# EAGLE design Power+noise (EAGLE 6.5.0)
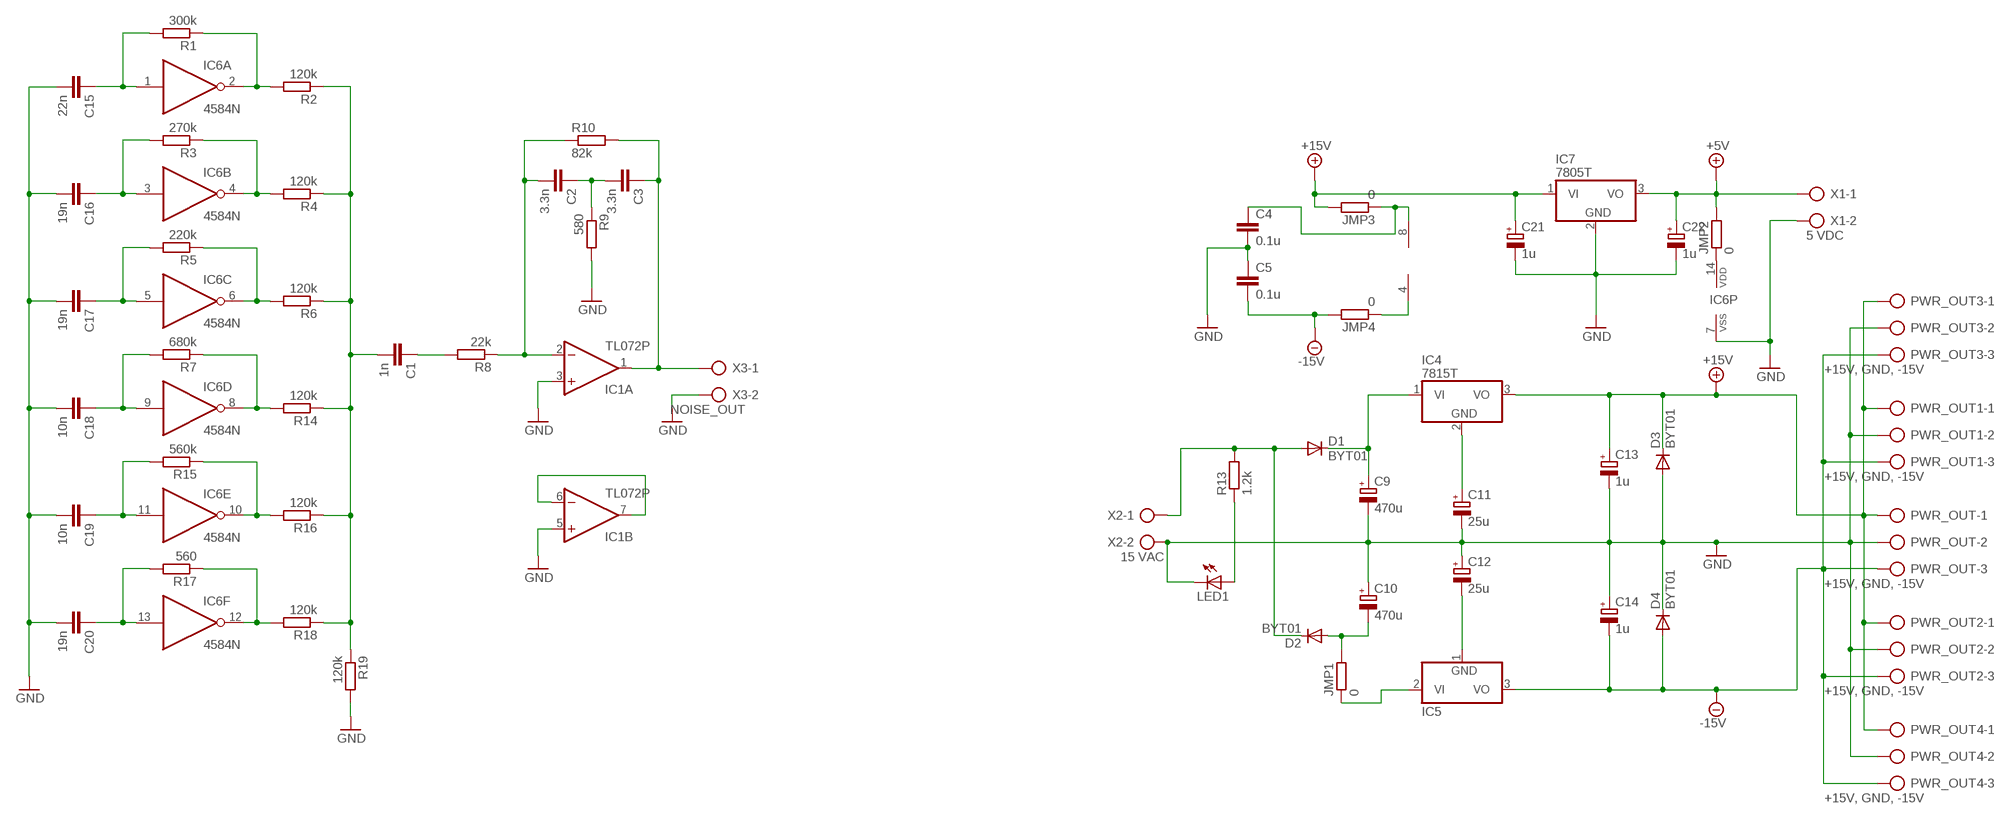
[diagram p0: schematic, sheet 1]

## Parts
C1  1n  C-EU075-042X103  [C075-042X103]
C2  3.3n  C-EU075-042X103  [C075-042X103]
C3  3.3n  C-EU075-042X103  [C075-042X103]
C4  0.1u  C-EU075-042X103  [C075-042X103]
C5  0.1u  C-EU075-042X103  [C075-042X103]
C9  470u  CPOL-EUE5-6  [E5-6]
C10  470u  CPOL-EUE5-6  [E5-6]
C11  25u  CPOL-EUE5-6  [E5-6]
C12  25u  CPOL-EUE5-6  [E5-6]
C13  1u  CPOL-EUE5-6  [E5-6]
C14  1u  CPOL-EUE5-6  [E5-6]
C15  22n  C-EU075-042X103  [C075-042X103]
C16  19n  C-EU075-042X103  [C075-042X103]
C17  19n  C-EU075-042X103  [C075-042X103]
C18  10n  C-EU075-042X103  [C075-042X103]
C19  10n  C-EU075-042X103  [C075-042X103]
C20  19n  C-EU075-042X103  [C075-042X103]
C21  1u  CPOL-EUE5-6  [E5-6]
C22  1u  CPOL-EUE5-6  [E5-6]
D1  BYT01  [F126-10]
D2  BYT01  [F126-10]
D3  BYT01  [F126-10]
D4  BYT01  [F126-10]
IC1  TL072P  [DIL08]
IC4  7815T  [TO220H]
IC5  7915T  [TO220H]
IC6  4584N  [DIL14]
IC7  7805T  [TO220H]
JMP1  0  R-EU_0207/10  [0207/10]
JMP2  0  R-EU_0207/10  [0207/10]
JMP3  0  R-EU_0207/12  [0207/12]
JMP4  0  R-EU_0207/10  [0207/10]
LED1  LED5MM  [LED5MM]
PWR_OUT  +15V, GND, -15V  AK300/3  [AK300/3]
PWR_OUT1  +15V, GND, -15V  AK300/3  [AK300/3]
PWR_OUT2  +15V, GND, -15V  AK300/3  [AK300/3]
PWR_OUT3  +15V, GND, -15V  AK300/3  [AK300/3]
PWR_OUT4  +15V, GND, -15V  AK300/3  [AK300/3]
R1  300k  R-EU_0207/5V  [0207/5V]
R2  120k  R-EU_0207/5V  [0207/5V]
R3  270k  R-EU_0207/5V  [0207/5V]
R4  120k  R-EU_0207/5V  [0207/5V]
R5  220k  R-EU_0207/5V  [0207/5V]
R6  120k  R-EU_0207/5V  [0207/5V]
R7  680k  R-EU_0207/5V  [0207/5V]
R8  22k  R-EU_0207/5V  [0207/5V]
R9  580  R-EU_0207/5V  [0207/5V]
R10  82k  R-EU_0207/5V  [0207/5V]
R13  1.2k  R-EU_0207/5V  [0207/5V]
R14  120k  R-EU_0207/5V  [0207/5V]
R15  560k  R-EU_0207/5V  [0207/5V]
R16  120k  R-EU_0207/5V  [0207/5V]
R17  560  R-EU_0207/5V  [0207/5V]
R18  120k  R-EU_0207/5V  [0207/5V]
R19  120k  R-EU_0207/5V  [0207/5V]
X1  5 VDC  AK300/2  [AK300/2]
X2  15 VAC  AK300/2  [AK300/2]
X3  NOISE_OUT  AK300/2  [AK300/2]

## Nets
+5V: C22.+ IC7.3(VO) JMP2.2 X1.1
+15V: C13.+ C21.+ D3.C IC4.3(VO) IC7.1(VI) JMP3.2 PWR_OUT1.1 PWR_OUT2.1 PWR_OUT3.1 PWR_OUT4.1 PWR_OUT.1
-15V: C5.2 C14.- D4.A IC5.3(VO) JMP4.2 PWR_OUT1.3 PWR_OUT2.3 PWR_OUT3.3 PWR_OUT4.3 PWR_OUT.3
GND: C4.2 C5.1 C9.- C10.+ C11.- C12.+ C13.- C14.+ C15.2 C16.2 C17.2 C18.2 C19.2 C20.2 C21.- C22.- D3.A D4.C IC1.3(A:+IN) IC1.5(B:+IN) IC6.7(P:VSS) IC7.2(GND) LED1.K(C) PWR_OUT1.2 PWR_OUT2.2 PWR_OUT3.2 PWR_OUT4.2 PWR_OUT.2 R9.2 R19.2 X1.2 X2.2 X3.2
N$1: C1.2 R2.1 R4.1 R6.1 R14.1 R16.1 R18.1 R19.1
N$2: IC6.12(F:O) R17.1 R18.2
N$3: IC6.10(E:O) R15.1 R16.2
N$4: IC6.8(D:O) R7.1 R14.2
N$5: IC6.6(C:O) R5.1 R6.2
N$6: IC6.4(B:O) R3.1 R4.2
N$7: IC6.2(A:O) R1.1 R2.2
N$8: C20.1 IC6.13(F:I) R17.2
N$9: C19.1 IC6.11(E:I) R15.2
N$10: C10.- D2.A JMP1.2
N$11: C1.1 R8.2
N$12: C2.2 IC1.2(A:-IN) R8.1 R10.1
N$13: C3.1 IC1.1(A:OUT) R10.2 X3.1
N$14: C2.1 C3.2 R9.1
N$15: C18.1 IC6.9(D:I) R7.2
N$16: C17.1 IC6.5(C:I) R5.2
N$17: C16.1 IC6.3(B:I) R3.2
N$18: C15.1 IC6.1(A:I) R1.2
N$19: D1.A D2.C R13.2 X2.1
N$20: LED1.A R13.1
N$21: IC1.6(B:-IN) IC1.7(B:OUT)
N$22: C9.+ D1.C IC4.1(VI)
N$23: IC5.2(VI) JMP1.1
N$24: C11.+ IC4.2(GND)
N$25: IC6.14(P:VDD) JMP2.1
N$26: C12.- IC5.1(GND)
N$27: IC1.4(P:V-) JMP4.1
N$28: C4.1 IC1.8(P:V+) JMP3.1

## Library data of the parts
C1-C5 C15-C20 = rcl:C-EU: CAPACITOR, European symbol
C9-C14 C21 C22 = rcl:CPOL-EU: POLARIZED CAPACITOR, European symbol
D1-D4 = diode:BYT01: DIODE ultra fast
IC1 = linear:TL072: OP AMP
IC4 IC7 = linear:78*: Positive VOLTAGE REGULATOR Source: http://cache.national.com/ds/LM/LM78L05.pdf http://www.fairchildsemi.com/ds/LM/LM7805.pdf
IC5 = linear:79*: Negative VOLTAGE REGULATOR
IC6 = 45xx:4584: Hex SCHMITT TRIGGER (74C14)
JMP1-JMP4 R1-R10 R13-R19 = rcl:R-EU_: RESISTOR, European symbol
LED1 = led:LED: LED OSRAM: - CHIPLED LG R971, LG N971, LY N971, LG Q971, LY Q971, LO R971, LY R971 LH N974, LH R974 LS Q976, LO Q976, LY Q976 LO Q996 - Hyper CHIPLED LW Q18S LB Q993, LB Q99A, LB R99A - SideLED LS A670, LO A670, LY A670, LG A670, LP A670 LB A673, LV A673, LT A673, LW A673 LH A674 LY A675 LS A676, LA A676, LO A676, LY A676, LW A676 LS A679, LY A679, LG A679 - Hyper Micro SIDELED® LS Y876, LA Y876, LO Y876, LY Y876 LT Y87S - SmartLED LW L88C, LW L88S LB L89C, LB L89S, LG L890 LS L89K, LO L89K, LY L89K LS L896, LA L896, LO L896, LY L896 - TOPLED LS T670, LO T670, LY T670, LG T670, LP T670 LSG T670, LSP T670, LSY T670, LOP T670, LYG T670 LG T671, LOG T671, LSG T671 LB T673, LV T673, LT T673, LW T673 LH T674 LS T676, LA T676, LO T676, LY T676, LB T676, LH T676, LSB T676, LW T676 LB T67C, LV T67C, LT T67C, LS T67K, LO T67K, LY T67K, LW E67C LS E67B, LA E67B, LO E67B, LY E67B, LB E67C, LV E67C, LT E67C LW T67C LS T679, LY T679, LG T679 LS T770, LO T770, LY T770, LG T770, LP T770 LB T773, LV T773, LT T773, LW T773 LH T774 LS E675, LA E675, LY E675, LS T675 LS T776, LA T776, LO T776, LY T776, LB T776 LHGB T686 LT T68C, LB T68C - Hyper Mini TOPLED® LB M676 - Mini TOPLED Santana® LG M470 LS M47K, LO M47K, LY M47K Source: http://www.osram.convergy.de LUXEON: - LUMILED® LXK2-PW12-R00, LXK2-PW12-S00, LXK2-PW14-U00, LXK2-PW14-V00 LXK2-PM12-R00, LXK2-PM12-S00, LXK2-PM14-U00 LXK2-PE12-Q00, LXK2-PE12-R00, LXK2-PE12-S00, LXK2-PE14-T00, LXK2-PE14-U00 LXK2-PB12-K00, LXK2-PB12-L00, LXK2-PB12-M00, LXK2-PB14-N00, LXK2-PB14-P00, LXK2-PB14-Q00 LXK2-PR12-L00, LXK2-PR12-M00, LXK2-PR14-Q00, LXK2-PR14-R00 LXK2-PD12-Q00, LXK2-PD12-R00, LXK2-PD12-S00 LXK2-PH12-R00, LXK2-PH12-S00 LXK2-PL12-P00, LXK2-PL12-Q00, LXK2-PL12-R00 Source: www.luxeon.com KINGBRIGHT: KA-3528ASYC Source: www.kingbright.com
PWR_OUT PWR_OUT1-PWR_OUT4 = con-ptr500:AK300/3: CONNECTOR; OC_FARNELL: unknown; OC_NEWARK: unknown
X1-X3 = con-ptr500:AK300/2: CONNECTOR; OC_FARNELL: unknown; OC_NEWARK: unknown

## Board
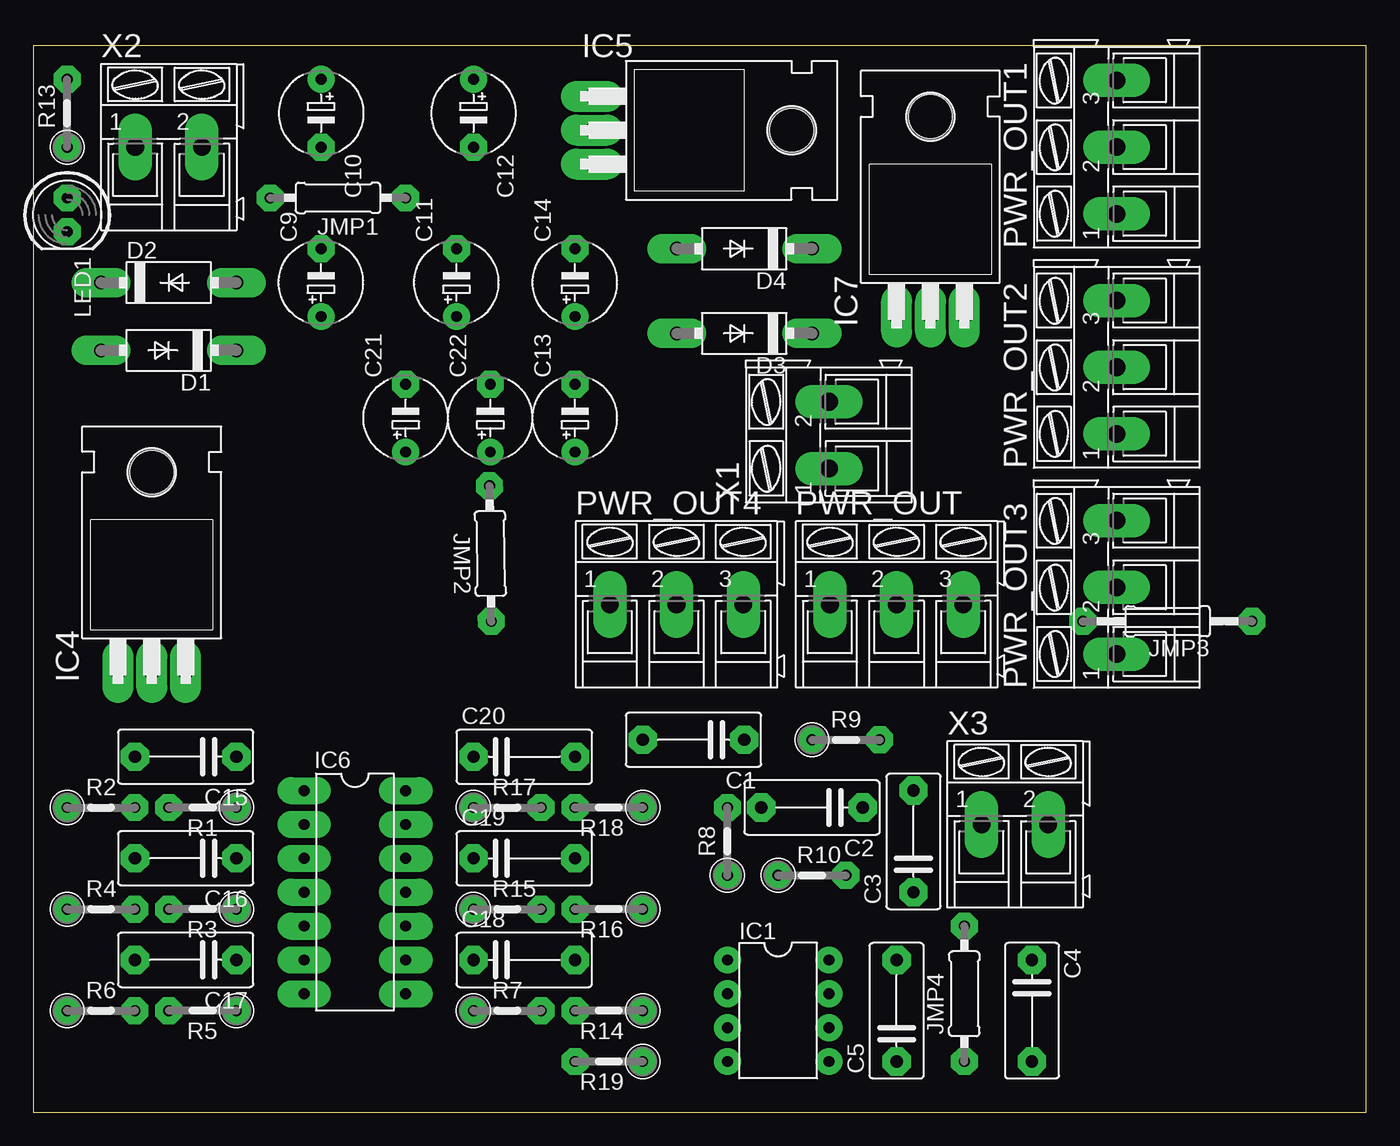
[diagram p1: board, top side]
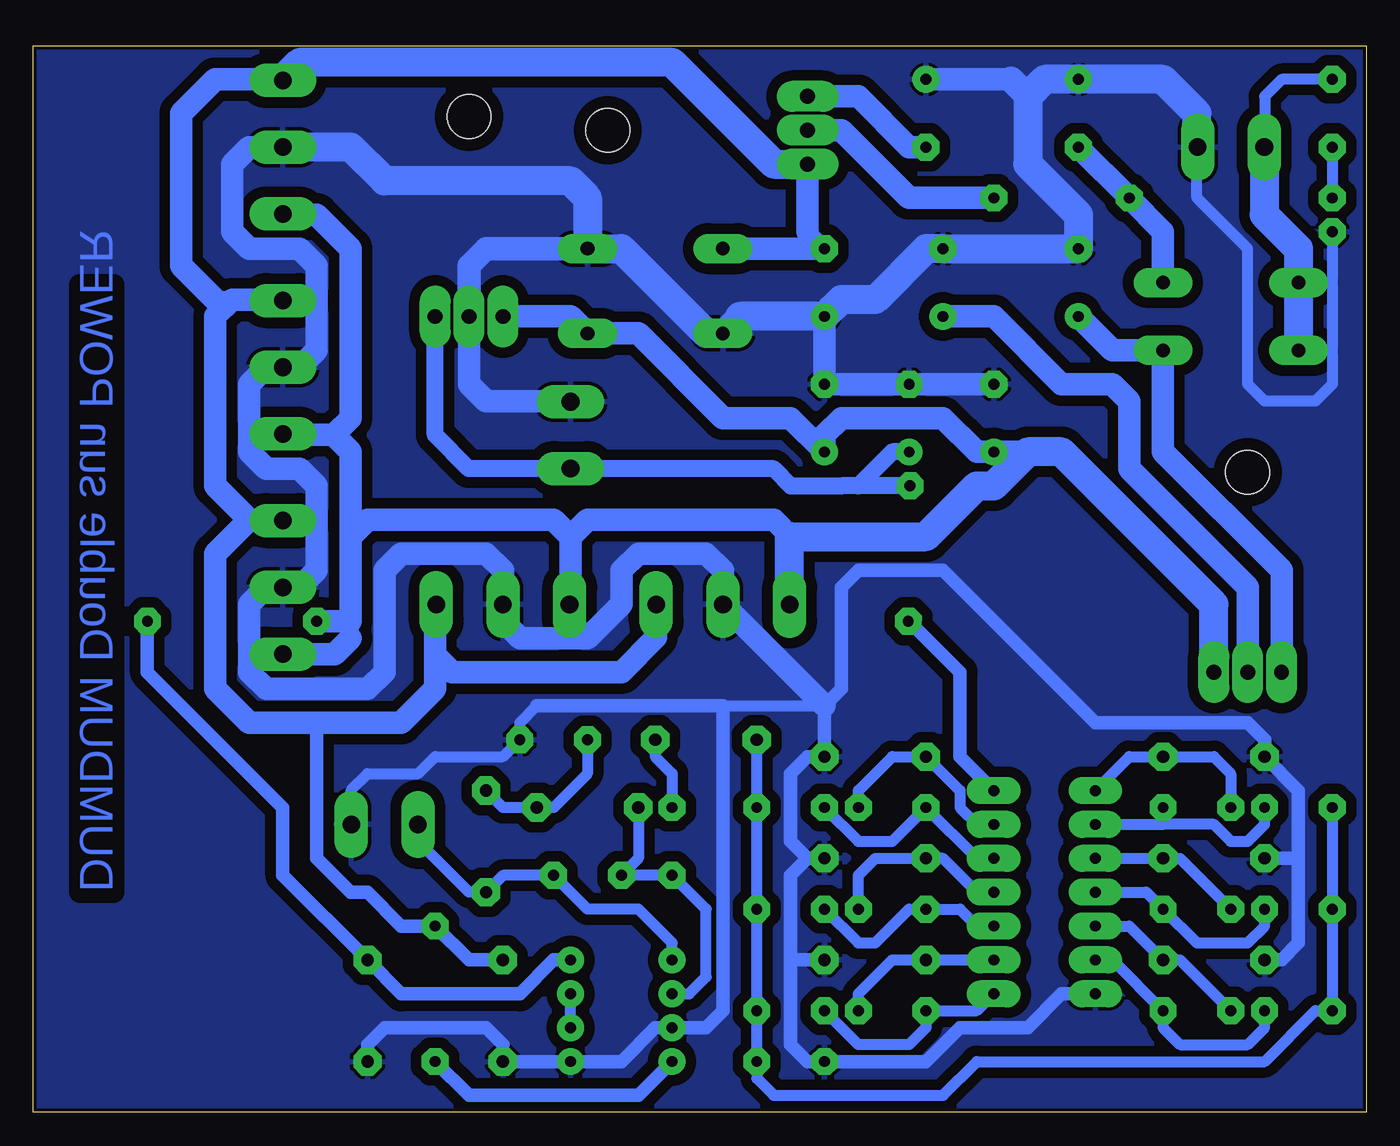
[diagram p2: board, bottom side, seen from below]

Size 100 x 80 mm. Coordinates in mm from the lower left corner, seen from the top.
Outline: 0,0 100,0 100,80 0,80 0,0
Copper layers (1*16): Top 0.035mm / dielectric 1.5mm / Bottom 0.035mm
Design rules "hobby-desingrules": minimum track width 0.8mm, minimum drill 0.8mm, track to track 0.8mm, track to pad 0.8mm, pad to pad 0.45mm, via to via 0.8mm, smd to smd 8mil, copper to edge 10mil, drill to drill 8mil, minimum pad ring 0.6mm, minimum via ring 0.6mm, stop-mask expansion 0mil, vias tented up to drill 0mil, thermal gap 10mil

### Footprints (pad centres in the part's own frame; a part is rotated, then mirrored left to right if it is on the bottom)
C075-042X103 = drill 0.914 octagon: 1 -3.81,0; 2 3.81,0
E5-6 = drill 0.813 pad 1.905: + -2.54,0 | drill 0.813 pad 1.905 octagon: - 2.54,0
F126-10 = drill 1.016 long: A 5.08,0; C -5.08,0
DIL08 = drill 0.813 pad 1.27: 1 -3.81,-3.81; 2 -1.27,-3.81; 3 1.27,-3.81; 4 3.81,-3.81; 5 3.81,3.81; 6 1.27,3.81; 7 -1.27,3.81; 8 -3.81,3.81
TO220H = drill 1.118 long: 1 -2.54,-10.16; 2 0,-10.16; 3 2.54,-10.16 | hole 3.302: 0,4.826
DIL14 = drill 0.813 long: 1 -7.62,-3.81; 2 -5.08,-3.81; 3 -2.54,-3.81; 4 0,-3.81; 5 2.54,-3.81; 6 5.08,-3.81; 7 7.62,-3.81; 8 7.62,3.81; 9 5.08,3.81; 10 2.54,3.81; 11 0,3.81; 12 -2.54,3.81; 13 -5.08,3.81; 14 -7.62,3.81
0207/10 = drill 0.813 octagon: 1 -5.08,0; 2 5.08,0
0207/12 = drill 0.813 octagon: 1 -6.35,0; 2 6.35,0
LED5MM = drill 0.813 octagon: A -1.27,0; K 1.27,0
AK300/3 = drill 1.321 long: 1 -5.004,0; 2 0,0; 3 5.004,0
0207/5V = drill 0.813 octagon: 1 -2.54,0; 2 2.54,0
AK300/2 = drill 1.321 long: 1 -2.515,0; 2 2.489,0

### Placement (x,y rotation side)
C1  49.53,27.94 180 top
C2  58.42,22.86 180 top
C3  66.04,20.32 90 top
C4  74.93,7.62 270 top
C5  64.77,7.62 90 top
C9  21.59,62.23 90 top
C10  21.59,74.93 270 top
C11  31.75,62.23 90 top
C12  33.02,74.93 270 top
C13  40.64,52.07 90 top
C14  40.64,62.23 90 top
C15  11.43,26.67 180 top
C16  11.43,19.05 180 top
C17  11.43,11.43 180 top
C18  36.83,11.43 0 top
C19  36.83,19.05 0 top
C20  36.83,26.67 0 top
C21  27.94,52.07 90 top
C22  34.29,52.07 90 top
D1  10.16,57.15 180 top
D2  10.16,62.23 0 top
D3  53.34,58.42 180 top
D4  53.34,64.77 180 top
IC1  55.88,7.62 270 top
IC4  8.89,43.18 0 top
IC5  52.07,73.66 270 top
IC6  24.13,16.51 270 top
IC7  67.31,69.85 0 top
JMP1  22.86,68.58 180 top
JMP2  34.29,41.91 90.8 top
JMP3  85.09,36.83 180 top
JMP4  69.85,8.89 90 top
LED1  2.54,67.31 270 top
PWR_OUT  64.77,38.1 0 top
PWR_OUT1  81.28,72.39 90 top
PWR_OUT2  81.28,55.88 90 top
PWR_OUT3  81.28,39.37 90 top
PWR_OUT4  48.26,38.1 0 top
R1  12.7,22.86 180 top
R2  5.08,22.86 0 top
R3  12.7,15.24 180 top
R4  5.08,15.24 0 top
R5  12.7,7.62 180 top
R6  5.08,7.62 0 top
R7  35.56,7.62 0 top
R8  52.07,20.32 90 top
R9  60.96,27.94 0 top
R10  58.42,17.78 0 top
R13  2.54,74.93 90 top
R14  43.18,7.62 180 top
R15  35.56,15.24 0 top
R16  43.18,15.24 180 top
R17  35.56,22.86 0 top
R18  43.18,22.86 180 top
R19  43.18,3.81 180 top
X1  59.69,50.8 90 top
X2  10.16,72.39 0 top
X3  73.66,21.59 0 top

### Tracks (layer width: path | path; a pad name or v marks a point on that pad's centre or on a via)
+5V
  Bottom 1.27: C22.+ 35.56,49.53 38.1,46.99 39.37,46.99 | JMP2.2 39.37,46.99 | 39.37,46.99 | 39.37,46.99 43.18,46.99 44.45,48.26 59.72,48.26 | 60.96,48.26 59.72,48.26 | 59.72,48.26 X1.1 67.33,48.28 69.85,50.8 IC7.3
+15V
  Bottom 1.27: 59.69,38.02 PWR_OUT.1 | 81.36,50.8 PWR_OUT2.1 81.2,50.8 | 81.36,67.31 PWR_OUT1.1 | 76.2,35.56 76.2,36.83 | 43.26,43.1 43.18,43.18
  Bottom 1.676: IC7.1 59.69,59.69 D3.C 54.61,58.42 48.26,52.07 43.18,52.07 C13.+ 40.64,50.8 39.37,52.07 31.75,52.07 29.21,49.53 C21.+ 25.4,49.53 | 81.36,67.31 78.74,67.31 76.2,64.77 76.2,52.07 77.47,50.8 | 77.47,50.8 81.2,50.8 | PWR_OUT3.1 77.39,34.37 76.2,35.56 | 76.2,43.18 76.2,36.83 JMP3.2 | 76.2,43.18 76.2,49.53 77.47,50.8 | 59.69,38.02 59.69,43.18 | 59.69,43.18 60.96,44.45 74.93,44.45 76.2,43.18 | 59.69,43.18 58.42,44.45 44.45,44.45 43.18,43.18
  Bottom 2.184: IC4.3 11.43,38.1 22.86,49.53 25.4,49.53 27.94,46.99 29.21,46.99 33.02,43.18 43.18,43.18 | PWR_OUT4.1 43.26,43.1
-15V
  Bottom 1.016: C5.2 67.31,11.43 JMP4.2 72.39,13.97 74.93,16.51 76.2,16.51 78.74,19.05 78.74,29.21
  Bottom 1.27: 41.91,66.04 C14.- | 81.28,77.47 PWR_OUT1.3 | 69.85,38.1 69.85,38.18 PWR_OUT.3 69.85,38.02 | PWR_OUT3.3 81.2,44.45 83.82,44.45 83.74,44.37 | 81.2,60.96 PWR_OUT2.3 | 85.09,60.96 86.36,60.96
  Bottom 1.676: IC5.3 41.91,66.04 | C14.- D4.A | 81.2,60.96 85.09,60.96 86.36,59.69 86.36,46.99 83.82,44.45 86.36,41.91 86.36,31.75 83.82,29.21 78.74,29.21 72.39,29.21 69.85,31.75 69.85,34.29 | 86.36,60.96 88.9,63.5 88.9,74.93 86.36,77.47 81.36,77.47 | PWR_OUT3.3 83.74,44.37 | 69.85,34.29 69.85,38.02 | PWR_OUT4.3 53.26,35.64 55.88,33.02 68.58,33.02 69.85,34.29
  Bottom 2.184: IC5.3 44.45,71.12 52.07,78.74 80.01,78.74 81.28,77.47 | 81.36,77.47 PWR_OUT1.3
GND
  Bottom 0.813: 12.7,72.34 12.7,68.58 8.89,64.77 8.89,54.61 7.62,53.34 3.81,53.34 2.54,54.61 LED1.K | 48.26,30.48 40.64,30.48 | 62.23,30.48 63.5,29.21 R9.2 64.77,26.67 69.85,26.67 71.12,25.4 74.93,25.4 76.15,24.18 X3.2 | 64.77,5.08 C5.1
  Bottom 1.016: 41.91,19.05 43.18,20.32 43.18,25.4 41.91,26.67 C20.2 40.64,30.48 39.37,31.75 39.37,39.37 38.1,40.64 31.75,40.64 20.32,29.21 8.89,29.21 7.62,27.94 C15.2 5.08,24.13 5.08,19.05 | 41.91,19.05 C19.2 | 43.18,11.43 43.18,17.78 41.91,19.05 | C18.2 43.18,11.43 | 5.08,19.05 5.08,12.7 6.35,11.43 C17.2 | C16.2 5.08,19.05 | IC6.7 22.86,8.89 25.4,6.35 30.48,6.35 33.02,3.81 R19.2 41.91,3.81 43.18,5.08 43.18,11.43 | 62.23,30.48 48.26,30.48 48.26,7.62 49.53,6.35 IC1.3 53.34,6.35 55.88,3.81 IC1.5 C5.1 | C4.2 74.93,5.08 73.66,6.35 66.04,6.35 64.77,5.08
  Bottom 1.27: 82.55,55.88 PWR_OUT2.2 | 80.01,39.37 PWR_OUT3.2 | 59.74,53.34 X1.2
  Bottom 1.676: C14.+ C13.- C22.- C21.- | PWR_OUT2.2 80.01,55.88 78.74,57.15 78.74,63.5 80.01,64.77 83.82,64.77 85.09,66.04 85.09,71.12 83.82,72.39 PWR_OUT1.2 | 82.55,55.88 83.82,54.61 83.82,49.53 82.55,48.26 80.01,48.26 78.74,46.99 78.74,40.64 80.01,39.37 | PWR_OUT3.2 82.55,39.37 83.82,38.1 83.82,33.02 82.55,31.75 74.93,31.75 73.66,33.02 73.66,40.64 72.39,41.91 66.04,41.91 64.77,40.64 PWR_OUT.2 64.77,36.83 63.5,35.56 58.42,35.56 55.88,38.1 55.88,40.64 54.61,41.91 49.53,41.91 48.26,40.64 PWR_OUT4.2 40.64,30.48 | IC7.2 67.31,54.61 66.04,53.34 59.74,53.34 | 26.67,77.47 C12.+
  Bottom 1.778: D4.C 66.04,64.77 67.31,63.5 IC7.2
  Bottom 1.93: 12.7,72.34 X2.2 | 26.67,77.47 25.4,76.2 | 46.99,59.69 D3.A
  Bottom 2.184: 12.7,72.34 12.7,74.93 15.24,77.47 C10.+ 24.13,77.47 25.4,76.2 25.4,71.12 21.59,67.31 C9.- C11.- 33.02,64.77 36.83,60.96 39.37,60.96 C14.+ 46.99,59.69 | D3.A 49.53,58.42 55.88,64.77 D4.C 58.42,68.58 59.69,69.85 73.66,69.85 76.2,72.39 PWR_OUT1.2
  pour Bottom: 0,80.01 100.33,80.01 100.33,0 0,0
N$1
  Bottom 0.813: R2.1 R4.1 R6.1 3.81,7.62 7.62,3.81 29.21,3.81 31.75,1.27 44.45,1.27 45.72,2.54 R19.1 R14.1 R16.1 R18.1 C1.2
N$2
  Bottom 0.813: IC6.12 29.21,19.05 R17.1 35.56,20.32 38.1,20.32 R18.2
N$3
  Bottom 0.813: IC6.10 29.21,13.97 30.48,15.24 R15.1 34.29,15.24 36.83,12.7 38.1,12.7 R16.2
N$4
  Bottom 0.813: IC6.8 29.21,7.62 R7.1 33.02,6.35 34.29,5.08 38.1,5.08 R14.2
N$5
  Bottom 0.813: IC6.6 19.05,11.43 R5.1 15.24,6.35 13.97,5.08 8.89,5.08 7.62,6.35 R6.2
N$6
  Bottom 0.813: IC6.4 16.51,16.51 R3.1 12.7,12.7 8.89,12.7 7.62,13.97 R4.2
N$7
  Bottom 0.813: IC6.2 15.24,21.59 | R2.2 7.62,21.59 8.89,20.32 10.16,20.32 11.43,21.59 15.24,21.59 | 15.24,21.59 R1.1
N$8
  Bottom 0.813: R17.2 38.1,24.13 35.56,26.67 C20.1 30.48,24.13 30.48,22.86 29.21,21.59 IC6.13
N$9
  Bottom 0.813: R15.2 38.1,17.78 36.83,19.05 C19.1 31.75,19.05 29.21,16.51 IC6.11
N$10
  Bottom 1.676: C10.- JMP1.2 15.24,66.04 D2.A
N$11
  Bottom 0.813: C1.1 53.34,26.67 52.07,25.4 R8.2
N$12
  Bottom 0.813: C2.2 54.61,19.05 R10.1 R8.1 49.53,15.24 49.53,10.16 50.8,8.89 IC1.2
N$13
  Bottom 0.813: IC1.1 52.07,12.7 54.61,15.24 58.42,15.24 R10.2 64.77,17.78 C3.1 67.31,16.51 71.12,20.32 71.12,21.57 X3.1
N$14
  Bottom 0.813: C3.2 64.77,22.86 C2.1 60.96,22.86 58.42,25.4 R9.1
N$15
  Bottom 0.813: R7.2 38.1,8.89 35.56,11.43 C18.1 IC6.9
N$16
  Bottom 0.813: IC6.5 17.78,13.97 C17.1 13.97,11.43 R5.2
N$17
  Bottom 0.813: IC6.3 C16.1 13.97,19.05 R3.2
N$18
  Bottom 0.813: IC6.1 17.78,26.67 C15.1 11.43,26.67 10.16,25.4 R1.2
N$19
  Bottom 0.813: R13.2 6.35,77.47 7.62,76.2 7.62,72.42 X2.1
  Bottom 2.184: X2.1 7.64,67.33 5.08,64.77 D2.C D1.A
N$20
  Bottom 0.813: R13.1 LED1.A
N$21
  Bottom 0.813: IC1.6 IC1.7
N$22
  Bottom 1.676: C9.+ 19.05,57.15 D1.C 15.24,49.53 6.35,40.64 IC4.1
N$23
  Bottom 1.676: JMP1.1 34.29,68.58 39.37,73.66 IC5.2
N$24
  Bottom 1.676: IC4.2 8.89,39.37 17.78,48.26 17.78,53.34 19.05,54.61 22.86,54.61 27.94,59.69 C11.+
N$25
  Bottom 0.813: 34.29,36.83 JMP2.1
  Bottom 1.016: IC6.14 30.48,26.67 30.48,33.02 34.29,36.83
N$26
  Bottom 1.676: C12.- 34.29,72.39 38.1,76.2 IC5.1
N$27
  Bottom 1.016: JMP4.1 67.31,1.27 54.61,1.27 IC1.4
N$28
  Bottom 1.016: IC1.8 60.96,11.43 63.5,8.89 72.39,8.89 C4.1 81.28,17.78 81.28,22.86 91.44,33.02 JMP3.1

### Text on the board
Bottom: DUMDUM Double sun POWER